# Altium schematic sheet RS485 BUS - Isolated.SchDoc
size A4; DrawnBy: Parsa Malekpour; Engineer: Parsa Malekpour; Organization: Atrotech; Address1: www.atrotech.ir; Address2: +98 90 369 22 999; Address3: Tehran; Address4: IRAN
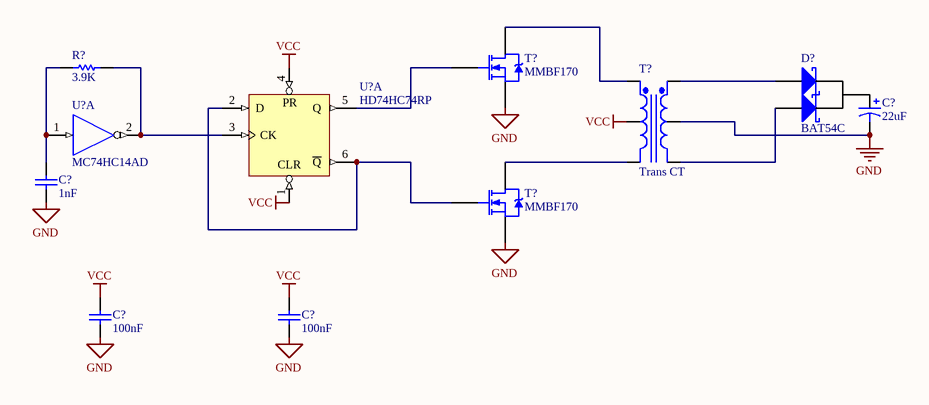
[diagram p0: RS485 BUS - Isolated.SchDoc]

## Parts
(Parts that share a designator on the sheet are numbered #1, #2 ... from top to bottom, then left to right.)
C?#1  22uF  [CAP-SMD-6]
C?#2  1nF  [C1206]
C?#3  100nF  [C1206]
C?#4  100nF  [C1206]
D?  BAT54C  [SOT-23]
R?  3.9K  [R805]
T?#1  MMBF170  [sot-23]
T?#2  Trans CT  [TRF_5]
T?#3  MMBF170  [sot-23]
U?#1  HD74HC74RP  [PRSP0014DE-A_N]  (part A of 2)
U?#2  MC74HC14AD  [751A-02_L]  (part A of 6)

## Nets
GND: C?#1.2 C?#2.1 C?#3.1 C?#4.1 T?#1.2(S) T?#2.5(PriCT) T?#3.2(S) U?#2.7(GND)
VCC: C?#3.2 C?#4.2 T?#2.2(SecCT) U?#1.1(~{CLR}) U?#1.4(~{PR})
VDD: U?#2.14(VDD)
NetC?#1_1: C?#1.1 D?.3(K)
NetC?#2_2: C?#2.2 R?.1 U?#2.1(A)
NetD?_1: D?.1(A) T?#2.6(Pri+)
NetD?_2: D?.2(A) T?#2.2(Pri-)
NetR?_2: R?.2 U?#1.3(CK) U?#2.2(Y)
NetT?#1_1: T?#1.1(G) U?#1.5(Q)
NetT?#1_3: T?#1.3(D) T?#2.1(Sec+)
NetT?#2_3: T?#2.3(Sec-) T?#3.3(D)
NetT?#3_1: T?#3.1(G) U?#1.2(D) U?#1.6(~{Q})

Not connected (* = marked no-connect by the designer): U?#1 7(GND) 14(VCC)

## Notes on the sheet
- Title
- Size:
- Date:
- A4
- Number:
- Time:
- Revision:
- Sheet
- of
- Atrotech co.
- www.atrotech.ir <http://www.atrotech.ir>
- +98 90 369 22 999
- Tehran
- IRAN
- File:
- (in symbol HD74HC74RP, part A) PR; CLR

## Library data of the parts
C?#1 = CAP-POL: Polar Capacitor; Voltage: 10V; Value: 22uF
C?#2-C?#4 = Cap: Capacitor; Designer: Parsa Malekpour
  C?#2: Value: 1nF
  C?#3 C?#4: Value: 100nF
D? = BAT54C: SURFACE MOUNT SCHOTTKY BARRIER DIODE
R? = Resistor: Designer: Parsa Malekpour; Value: 3.9K
T?#1 T?#3 = MMBF170: N-CHANNEL ENHANCEMENT MODE MOSFET
T?#2 = Trans CT: Center-Tapped Transformer (Coupled Inductor Model); Published: 8-Jun-2000; LatestRevisionDate: 17-Jul-2002; LatestRevisionNote: Re-released for DXP Platform.; PackageReference: TRF_5; Publisher: Altium Limited; PackageDescription: Transformer; 5 Leads
U?#1 = HD74HC74RP: Dual D-Type Flip-Flops with Preset and Clear; Published: 10-Feb-2010; DatasheetVersion: Rev.3.00, Oct-2008; PackageVersion: Sep-2005; PackageReference: PRSP0014DE-A; Publisher: Altium Limited; PackageDescription: 14-Pin Plastic Small Outline Integrated Circuit 8.65 x 3.95 mm Body, 1.27 mm Pitch; Code_JEITA: P-SOP14-3.95x8.65-1.27; ComponentLink1Description: Manufacturer Link; ComponentLink1URL: http://sg.renesas.com/fmwk.jsp?cnt=hd74hc_root.jsp&fp=/products/standard_ic/general_purpose_logic/5v_standard_logic/hd74hc/; ComponentLink2Description: Datasheet; ComponentLink2URL: http://documentation.renesas.com/eng/products/logic/rej03d0549_hd74hc74ds.pdf; ComponentLink3Description: Packaging Specification; ComponentLink3URL: http://sg.renesas.com/media/products/common_info/package/pdf/ic/code/prsp0014de_a.pdf
U?#2 = MC74HC14AD: Hex Schmitt Trigger Inverter; Published: 17-Jul-2002; LatestRevisionDate: 13-Apr-2006; LatestRevisionNote: IPC-7351 Footprint Added.; DatasheetVersion: 1989; PackageVersion: 1991; PackageReference: 751A-02; Publisher: Altium Limited; PackageDescription: 14-Pin Small Outline Integrated Circuit 1.27 mm Pitch; Code_IPC: SOIC127P600-14; ComponentLink1Description: Manufacturer Link; ComponentLink1URL: http://www.onsemi.com/site/products/parametrics/0,4446,247,00.html; ComponentLink2Description: Ibis Model; ComponentLink2URL: http://www.onsemi.com/pub/Collateral/MC54HC14AJ.IBS